# EAGLE design Driver Low (EAGLE 8.2.2)

## Sheet 1 of 2: Right, 200 mA
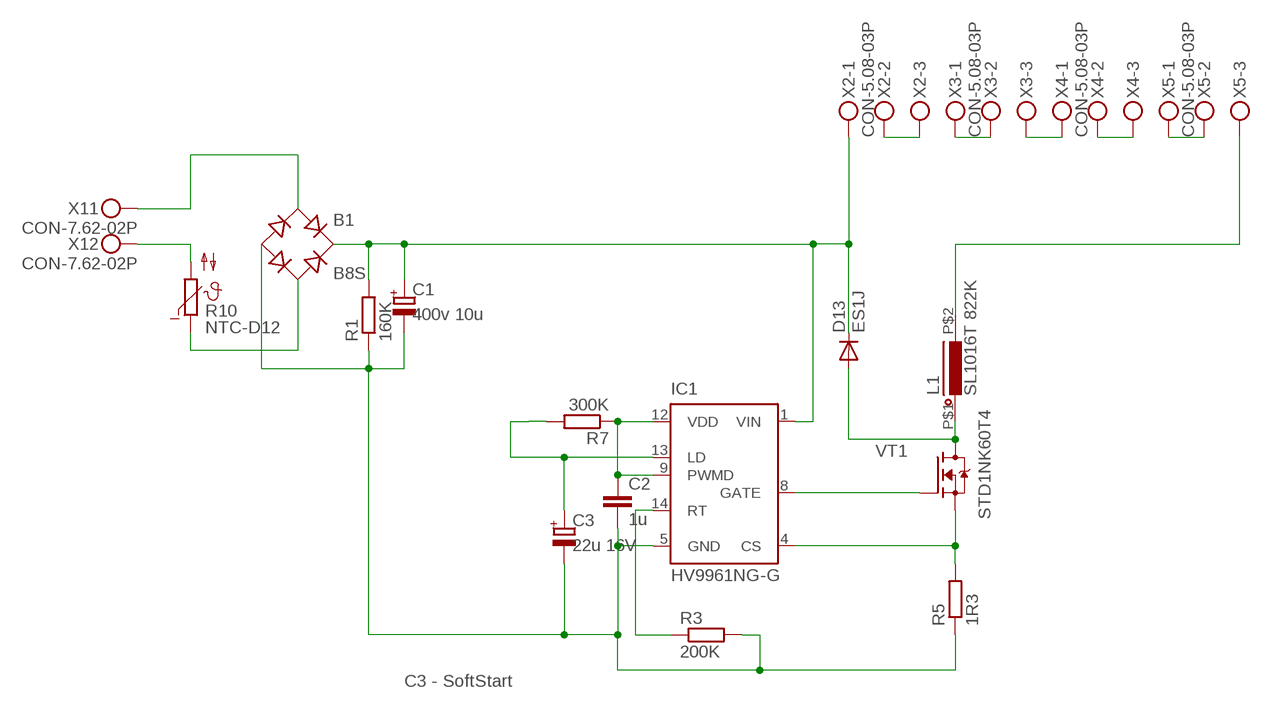
[diagram p0: schematic, sheet 1]

### Parts
B1  B8S  B6S  [MBS]
C1  400v 10u  CAP-POL_E3.5-8  [E3,5-8]
C2  1u  CAP_0805  [C0805]
C3  22u 16V  CAP-POL_3528  [CT3528]
D13  ES1J  DIODE_ES1J  [DO214AC]
IC1  HV9961NG-G  HV9910BNG  [SOIC-16NG]
L1  SL1016T 822K  INDUCTORSL1016  [SL1016]
R1  160K  R_MF-0125  [MF-0125]
R3  200K  R_0805  [R0805]
R5  1R3  R_0805  [R0805]
R7  300K  R_0805  [R0805]
R10  NTC-D12  [NTC-D12]
VT1  STD1NK60T4  FET-NDPAK  [DPAK]
X1  CON-7.62-02P  [KF25C-7.62-02P-13]
X2  CON-5.08-03P  [MKDSN1,5/3-5,08]
X3  CON-5.08-03P  [MKDSN1,5/3-5,08]
X4  CON-5.08-03P  [MKDSN1,5/3-5,08]
X5  CON-5.08-03P  [MKDSN1,5/3-5,08]

### Nets
N$1: X2.2 X2.3
N$2: C3.+ IC1.13(LD) R7.2
N$3: C2.1 IC1.9(PWMD) IC1.12(VDD) R7.1
N$4: X3.1 X3.2
N$5: X3.3 X4.1
N$6: X4.2 X4.3
N$7: X5.1 X5.2
N$12: B1.AC1 X1.P$1
N$13: B1.AC2 R10.1
N$14: B1.- C1.- C2.2 C3.- IC1.5(GND) R1.1 R3.2 R5.1
N$17: B1.+ C1.+ D13.C IC1.1(VIN) R1.2 X2.1
N$19: IC1.4(CS) R5.2 VT1.S
N$20: IC1.14(RT) R3.1
N$21: IC1.8(GATE) VT1.G
N$22: L1.P$2 X5.3
N$23: D13.A L1.P$1 VT1.D
N$34: R10.2 X1.P$2

### Notes on the sheet
- C3 - SoftStart

## Sheet 2 of 2: Left, 100 mA
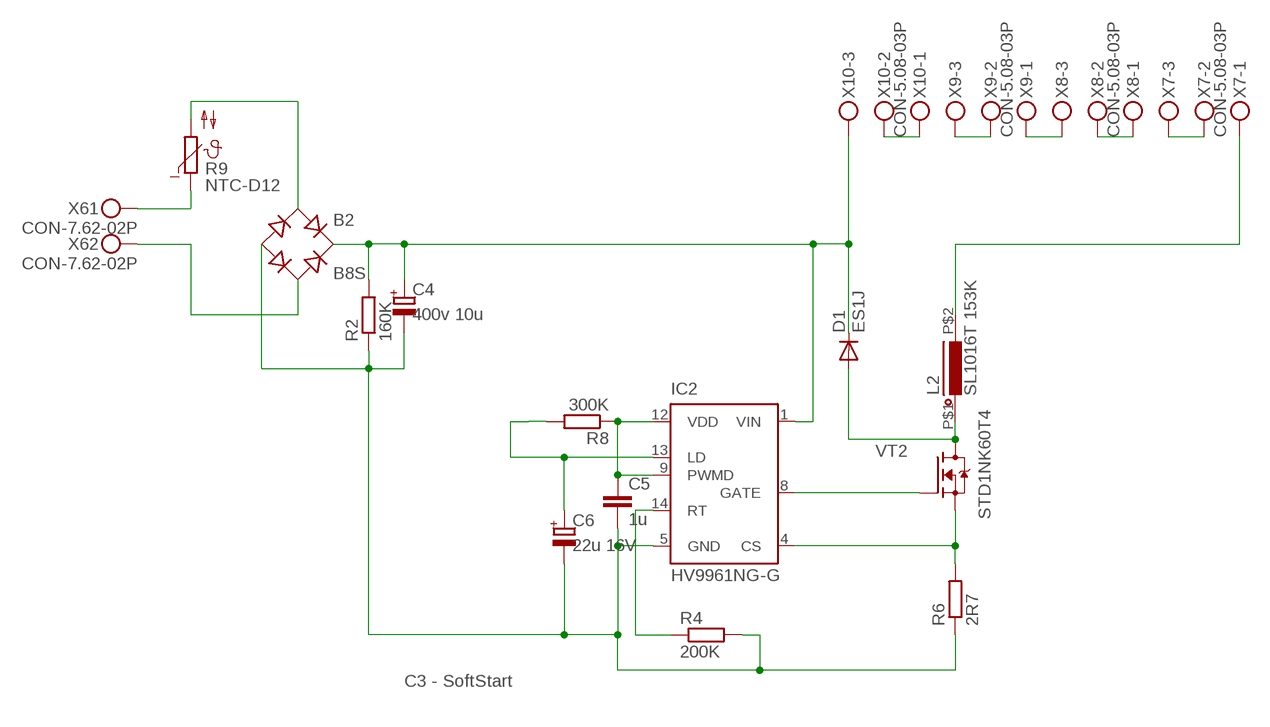
[diagram p1: schematic, sheet 2]

### Parts
B2  B8S  B6S  [MBS]
C4  400v 10u  CAP-POL_E3.5-8  [E3,5-8]
C5  1u  CAP_0805  [C0805]
C6  22u 16V  CAP-POL_3528  [CT3528]
D1  ES1J  DIODE_ES1J  [DO214AC]
IC2  HV9961NG-G  HV9910BNG  [SOIC-16NG]
L2  SL1016T 153K  INDUCTORSL1016  [SL1016]
R2  160K  R_MF-0125  [MF-0125]
R4  200K  R_0805  [R0805]
R6  2R7  R_0805  [R0805]
R8  300K  R_0805  [R0805]
R9  NTC-D12  [NTC-D12]
VT2  STD1NK60T4  FET-NDPAK  [DPAK]
X6  CON-7.62-02P  [KF25C-7.62-02P-13]
X7  CON-5.08-03P  [MKDSN1,5/3-5,08]
X8  CON-5.08-03P  [MKDSN1,5/3-5,08]
X9  CON-5.08-03P  [MKDSN1,5/3-5,08]
X10  CON-5.08-03P  [MKDSN1,5/3-5,08]

### Nets
N$8: B2.AC1 R9.2
N$9: B2.AC2 X6.P$2
N$10: IC2.14(RT) R4.1
N$11: IC2.8(GATE) VT2.G
N$15: L2.P$2 X7.1
N$16: D1.A L2.P$1 VT2.D
N$18: IC2.4(CS) R6.2 VT2.S
N$24: B2.- C4.- C5.2 C6.- IC2.5(GND) R2.1 R4.2 R6.1
N$25: B2.+ C4.+ D1.C IC2.1(VIN) R2.2 X10.3
N$26: C6.+ IC2.13(LD) R8.2
N$27: C5.1 IC2.9(PWMD) IC2.12(VDD) R8.1
N$28: X7.2 X7.3
N$29: X8.1 X8.2
N$30: X8.3 X9.1
N$31: X9.2 X9.3
N$32: X10.1 X10.2
N$35: R9.1 X6.P$1

### Notes on the sheet
- C3 - SoftStart

## Library data of the parts
B1 B2 = rectifier:B*S: Surface Mount Glass Passivated Bridge Rectifiers Source: Comchip Bridge Rectifiers B05S-G_B10S-G.pdf
C1 C3 C4 C6 = Namenlos:CAP-POL_
C2 C5 = Namenlos:CAP_
D1 D13 = Namenlos:DIODE_
IC1 IC2 = Namenlos:HV9910B: Universal High Brightness LED Driver Source: www.supertex.com .. led_driver_ics_SG.pdf; OC_FARNELL: unknown; OC_NEWARK: unknown
L1 L2 = Namenlos:INDUCTOR
R1-R8 = Namenlos:R_
R9 R10 = Namenlos:NTC-D12
VT1 VT2 = Namenlos:FET-N
X1 X6 = Namenlos:CON-7.62-02P
X2-X5 X7-X10 = Namenlos:CON-5.08-03P: MKDSN 1,5/ 3-5,08 Printklemme Nennstrom: 13,5 A Nennspannung: 250 V Rastermaß: 5,08 mm Polzahl: 3 Anschlussart: Schraubanschluss Montage: Löten Anschlussrichtung Leiter/Platine: 0 ° Artikelnummer: 1729131 Source: http://eshop.phoenixcontact.com .. 1729131.pdf

## Board
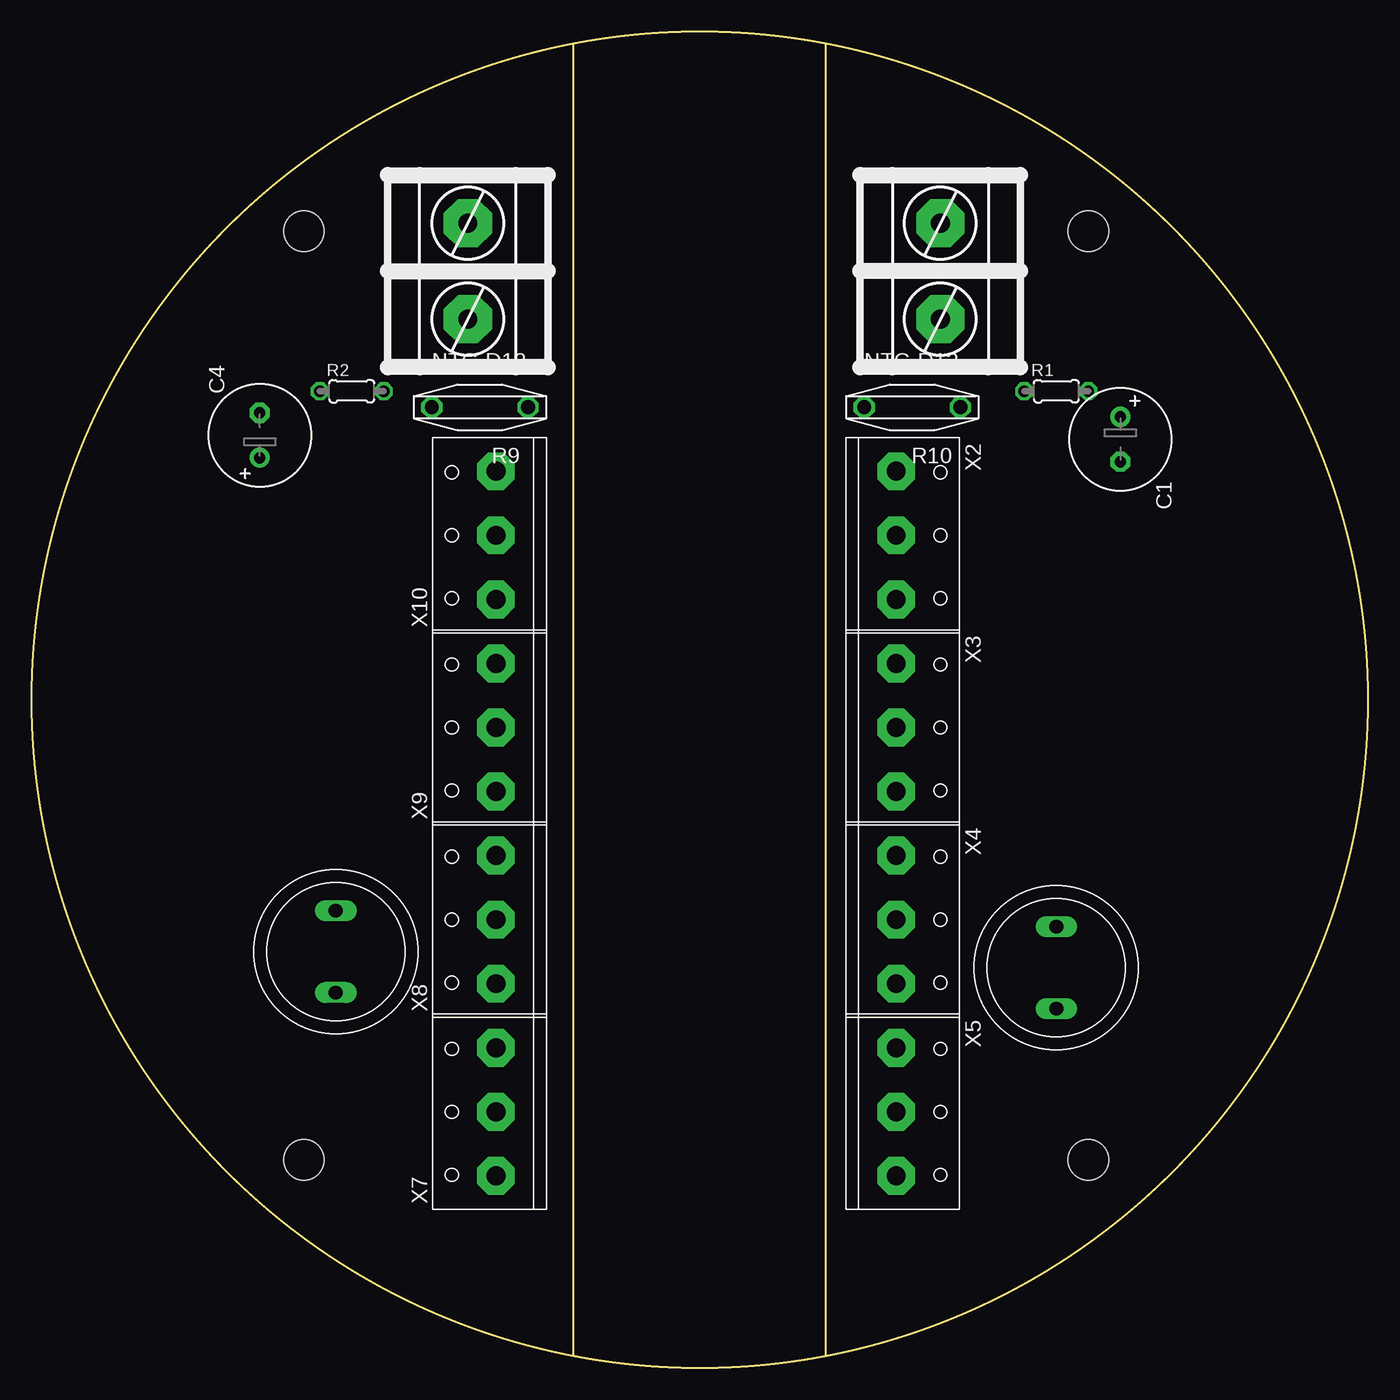
[diagram p2: board, top side]
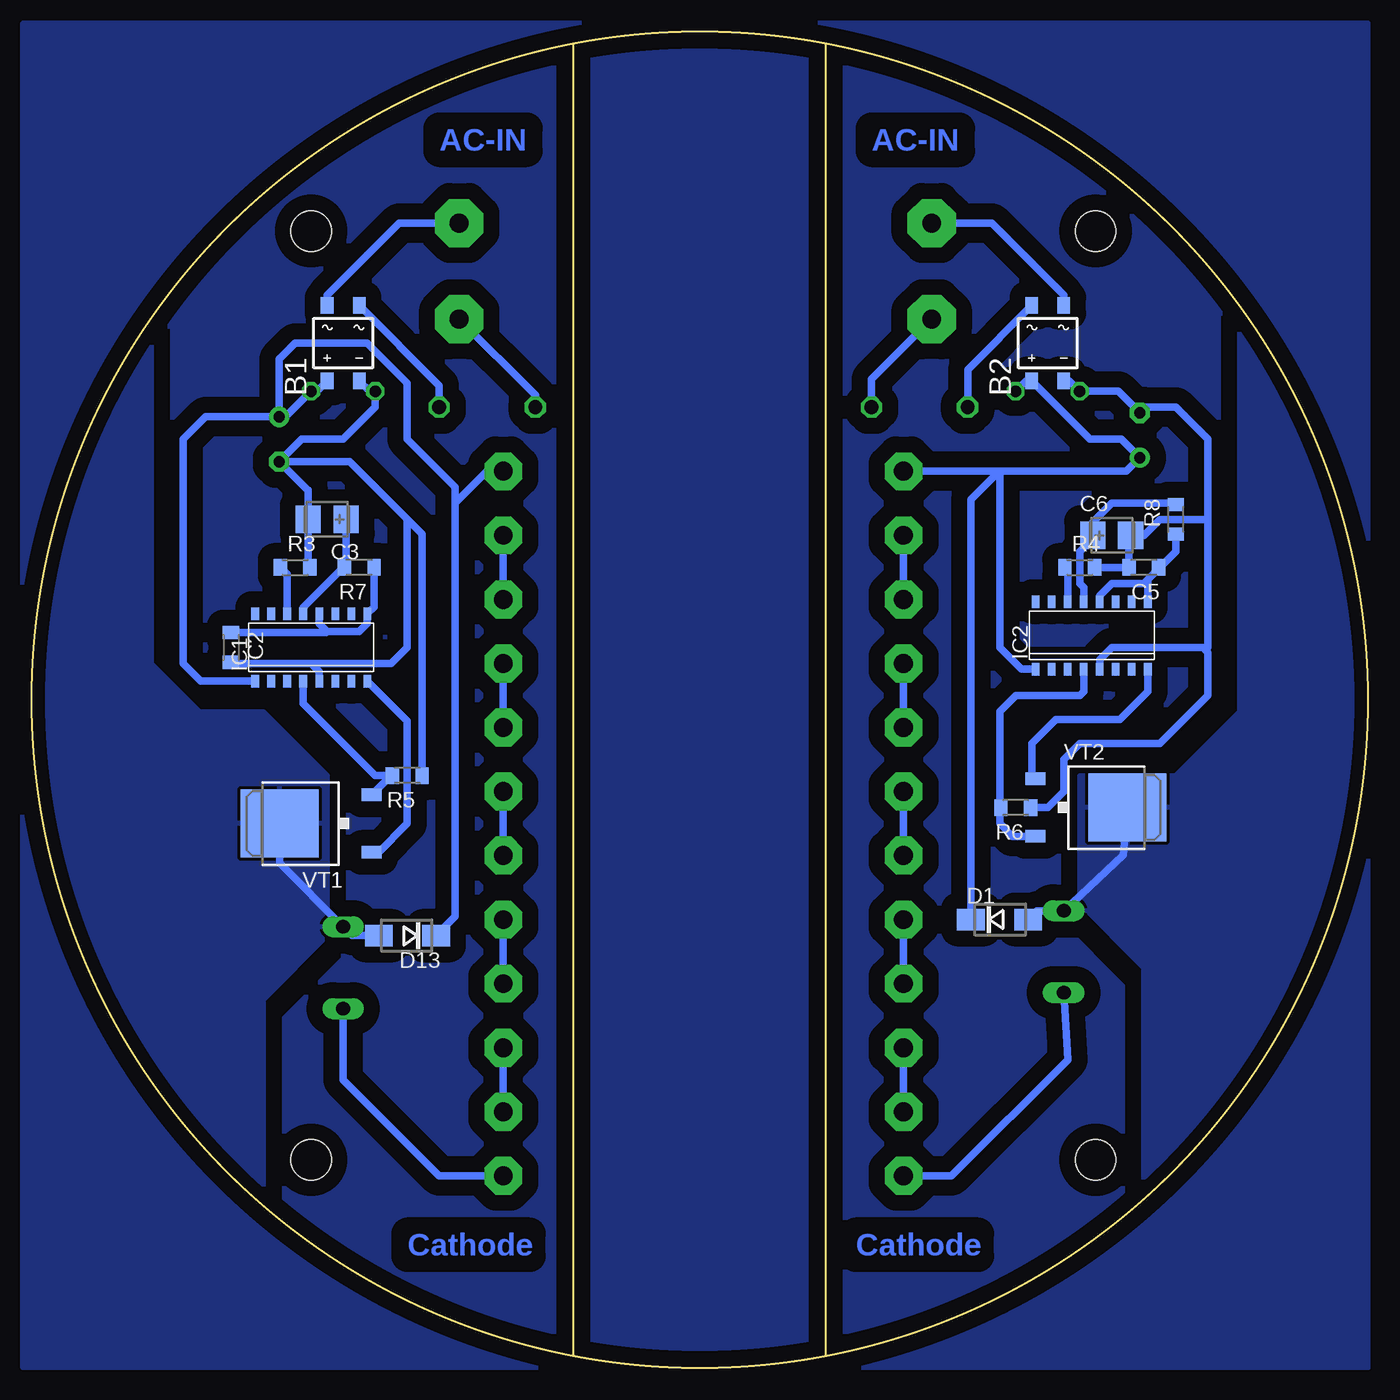
[diagram p3: board, bottom side, seen from below]

Size 106 x 106 mm. Coordinates in mm from the lower left corner, seen from the top.
Outline: 43,0.95 43,105.05
Outline: 63,0.95 63,105.05
Outline: circle at 53,53 radius 53
Copper layers (1*16): Top 0.035mm / dielectric 1.5mm / Bottom 0.035mm
Design rules "default": minimum track width 6mil, minimum drill 0.35mm, track to track 6mil, track to pad 6mil, pad to pad 6mil, via to via 6mil, smd to smd 6mil, copper to edge 40mil, drill to drill 6mil, minimum pad ring 10mil, minimum via ring 8mil, stop-mask expansion 4mil, vias tented up to drill 0mil, thermal gap 10mil
Holes 3.2 mm at 21.59,16.51 21.59,90.17 83.82,16.51 83.82,90.17

### Footprints (pad centres in the part's own frame; a part is rotated, then mirrored left to right if it is on the bottom)
MBS = smd 1 x 1.3: + -1.27,-3; - 1.27,-3; AC1 -1.27,3; AC2 1.27,3
E3,5-8 = drill 0.9 pad 1.6: + -1.778,0 | drill 0.9 pad 1.6 octagon: - 1.778,0
C0805 = smd 1.05 x 1.3: 1 -1.175,0; 2 1.175,0
CT3528 = smd 2 x 2.2: + -1.5,0; - 1.5,0
DO214AC = smd 2.2 x 1.7: A 2.25,0; C -2.285,0
SOIC-16NG = smd 0.6 x 1: 1 -4.445,-2.675; 2 -3.175,-2.675; 3 -1.905,-2.675; 4 -0.635,-2.675; 5 0.635,-2.675; 6 1.905,-2.675; 7 3.175,-2.675; 8 4.445,-2.675; 9 4.445,2.675; 10 3.175,2.675; 11 1.905,2.675; 12 0.635,2.675; 13 -0.635,2.675; 14 -1.905,2.675; 15 -3.175,2.675; 16 -4.445,2.675
SL1016 = drill 1.1 long: P$1 3.25,0; P$2 -3.25,0
MF-0125 = drill 0.9 octagon: 1 -2.54,0; 2 2.54,0
R0805 = smd 1.05 x 1.3: 1 -1.175,0; 2 1.175,0
NTC-D12 = drill 1.1 pad 1.676 octagon: 1 -3.81,0; 2 3.81,0
DPAK = smd 5.4 x 6.2: D 0,2.5 | smd 1 x 1.6: G -2.28,-4.8; S 2.28,-4.8
KF25C-7.62-02P-13 = drill 1.5 pad 3.81 octagon: P$1 -3.81,0; P$2 3.81,0
MKDSN1,5/3-5,08 = drill 1.5 pad 3 octagon: 1 -5.08,0; 2 0,0; 3 5.08,0

### Placement (x,y rotation side)
B1  81.28,81.28 0 bottom
B2  25.4,81.28 0 bottom
C1  86.36,73.66 270 top
C2  90.17,57.15 270 bottom
C3  82.55,67.31 180 bottom
C4  18.1,73.98 90 top
C5  17.78,63.5 180 bottom
C6  20.32,66.04 0 bottom
D1  29.21,35.56 0 bottom
D13  76.2,34.29 180 bottom
IC1  83.82,57.15 0 bottom
IC2  21.91,58.1 0 bottom
L1  81.28,31.75 90 top
L2  24.13,33.02 90 top
R1  81.28,77.47 0 top
R2  25.4,77.47 0 top
R3  85.09,63.5 0 bottom
R4  22.86,63.5 0 bottom
R5  76.2,46.99 180 bottom
R6  27.94,44.45 180 bottom
R7  80.01,63.5 180 bottom
R8  15.24,67.31 90 bottom
R9  35.56,76.2 180 top
R10  69.85,76.2 180 top
VT1  83.82,43.18 90 bottom
VT2  21.59,44.45 270 bottom
X1  72.07,87 270 top
X2  68.58,66.04 270 top
X3  68.58,50.8 270 top
X4  68.58,35.56 270 top
X5  68.58,20.32 270 top
X6  34.61,87 90 top
X7  36.83,20.32 90 top
X8  36.83,35.56 90 top
X9  36.83,50.8 90 top
X10  36.83,66.04 90 top

### Tracks (layer width: path | path; a pad name or v marks a point on that pad's centre or on a via)
N$1
  Bottom 0.61: X2.3 X2.2
N$2
  Bottom 0.61: IC1.13 84.45,60.33 81.28,63.5 | 81.28,63.5 R7.2 | C3.+ 81.05,63.73 81.28,63.5
N$3
  Bottom 0.61: R7.1 78.83,60.37 IC1.9 79.38,59.05 80.01,58.42 82.55,58.42 | IC1.12 83.19,59.05 82.55,58.42 | C2.1 82.64,58.33 82.55,58.42
N$4
  Bottom 0.61: X3.2 X3.1
N$5
  Bottom 0.61: X4.1 X3.3
N$6
  Bottom 0.61: X4.3 X4.2
N$7
  Bottom 0.61: X5.2 X5.1
N$8
  Bottom 0.61: R9.2 31.75,79.2 B2.AC1
N$9
  Bottom 0.61: X6.P$2 29.84,90.81 24.13,85.09 B2.AC2
N$10
  Bottom 0.61: IC2.14 23.81,63.09 R4.1
N$11
  Bottom 0.61: IC2.8 17.46,53.66 19.68,51.44 24.77,51.44 26.67,49.53 26.67,47.01 VT2.G
N$12
  Bottom 0.61: X1.P$1 76.83,90.81 82.55,85.09 B1.AC1
N$13
  Bottom 0.61: R10.1 73.66,77.93 B1.AC2
N$14
  Bottom 0.61: B1.- 79.2,77.47 R1.1 78.74,76.2 81.28,73.66 84.58,73.66 C1.- | IC1.5 83.19,55.24 83.82,55.88 | 83.82,55.88 90.08,55.88 C2.2 | C3.- 84.05,63.63 R3.2 | C3.- 84.33,67.31 | 83.82,55.88 77.47,55.88 76.2,57.15 76.2,67.31 76.38,67.49 | 76.38,67.49 78.56,69.67 | 78.56,69.67 78.74,69.85 | C3.- 84.05,69.62 84.1,69.62 C1.- | C1.- 80.77,71.88 78.56,69.67 | R5.1 75.03,66.14 76.38,67.49
N$15
  Bottom 0.61: L2.P$2 23.81,24.45 33.02,15.24 X7.1
N$16
  Bottom 0.61: VT2.D 19.41,40.67 L2.P$1 26.25,36.27 D1.A
  pour Bottom: 17.78,12.7 17.78,31.75 22.86,36.83 22.86,46.99 15.24,46.99 10.16,52.07 10.16,83.82 0,73.66 0,30.48
N$17
  Bottom 0.61: B1.+ 83.36,77.47 R1.2 85.85,75.44 86.34,75.44 | D13.C 72.39,35.81 72.39,68.58 | 72.39,68.58 69.85,71.12 X2.1 | IC1.1 92.58,54.48 93.98,55.88 93.98,73.66 92.36,75.28 92.2,75.44 C1.+ 86.34,75.44 | 72.39,68.58 72.39,69.85 76.2,73.66 76.2,78.11 79.38,81.28 85.09,81.28 86.36,80.01 86.36,75.46 86.34,75.44
N$18
  Bottom 0.61: IC2.4 22.54,53.66 22.86,53.34 27.94,53.34 29.21,52.07 29.21,44.35 | VT2.S 28.2,42.17 29.21,43.18 29.21,44.35 | 29.21,44.35 R6.2
N$19
  Bottom 0.61: 78.58,45.46 VT1.S 77.49,46.99 R5.2 78.74,46.99 82.61,50.85 | IC1.4 84.45,52.7 82.61,50.85 | 82.61,50.85 82.55,50.8
N$20
  Bottom 0.61: IC1.14 85.72,62.96 R3.1
N$21
  Bottom 0.61: 78.43,53.53 78.24,53.34 | 78.43,53.53 IC1.8 | VT1.G 78.48,40.9 76.2,43.18 76.2,51.3 78.43,53.53
N$22
  Bottom 0.61: X5.3 73.66,15.24 81.28,22.86 L1.P$2
N$23
  Bottom 0.61: VT1.D 86.32,40.04 L1.P$1 80.57,34.29 D13.A
  pour Bottom: 82.55,43.18 82.55,34.29 87.63,29.21 87.63,12.7 90.17,12.7 107.95,30.48 107.95,72.39 96.52,83.82 96.52,55.88 92.71,52.07 87.63,52.07 82.55,46.99
N$24
  Bottom 0.61: B2.- 23.67,78.28 R2.1 19.81,77.47 C4.- 17.65,76.2 15.24,76.2 12.7,73.66 12.7,67.31 | R4.2 C5.2 18.95,65.91 C6.- 17.78,66.04 16.51,67.31 13.97,67.31 12.7,67.31 | IC2.5 21.27,56.2 20.32,57.15 12.7,57.15 | 12.89,56.96 12.7,57.15 | 12.89,56.96 12.7,57.15 | 12.7,57.15 12.7,67.31 | R6.1 25.4,44.45 24.13,45.72 24.13,48.26 22.86,49.53 16.51,49.53 12.7,53.34 12.7,56.76 12.89,56.96
N$25
  Bottom 0.61: R2.2 27.13,78.28 B2.+ 22.05,73.66 19.56,73.66 C4.+ 19.18,71.12 29.24,71.12 | 29.24,71.12 X10.3 | IC2.1 27.49,55.43 29.21,57.15 29.21,71.09 29.24,71.12 | D1.C 31.5,68.87 29.24,71.12
N$26
  Bottom 0.61: IC2.13 22.54,61.91 22.86,62.23 22.86,64.77 21.82,65.81 C6.+ 21.82,67.08 20.32,68.58 15.34,68.58 R8.2
N$27
  Bottom 0.61: IC2.12 21.27,61.28 20.32,62.23 17.78,62.23 17.55,62.46 | 16.61,63.41 17.55,62.46 | 16.61,63.41 C5.1 | IC2.9 17.46,62.36 17.55,62.46 | R8.1 15.24,64.77 16.61,63.41
N$28
  Bottom 0.61: X7.3 X7.2
N$29
  Bottom 0.61: X8.2 X8.1
N$30
  Bottom 0.61: X8.3 X9.1
N$31
  Bottom 0.61: X9.3 X9.2
N$32
  Bottom 0.61: X10.2 X10.1
N$33
  pour Bottom (isolate 1.27, rank 6): 0,0 106.68,0 106.68,106.68 0,106.68
N$34
  Bottom 0.61: R10.2 66.04,77.15 X1.P$2
N$35
  Bottom 0.61: R9.1 39.37,78.42 X6.P$1

### Text on the board
Bottom: AC-IN | AC-IN | Cathode | Cathode